# EAGLE design COMPOSITE_SCH (EAGLE 9.2.2)
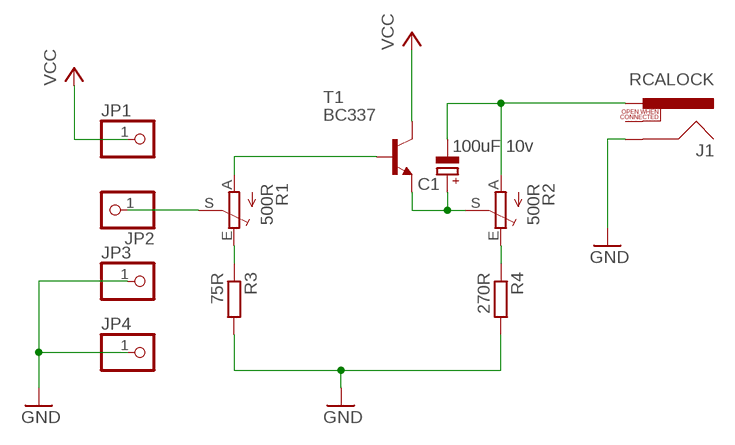
[diagram p0: schematic, sheet 1]

## Parts
C1  100uF 10v  CPOL-EUE2,5-6E  [E2,5-6E]
J1  RCALOCK  [RCA_LOCK]
JP1  PINHD-1X1  [1X01]
JP2  PINHD-1X1  [1X01]
JP3  PINHD-1X1  [1X01]
JP4  PINHD-1X1  [1X01]
R1  500R  TRIM_EU-CA6V  [CA6V]
R2  500R  TRIM_EU-CA6V  [CA6V]
R3  75R  R-EU_0207/10  [0207/10]
R4  270R  R-EU_0207/10  [0207/10]
T1  BC337  [TO92]

## Nets
GND: J1.SHELL JP3.1 JP4.1 R3.2 R4.2
N$1: R1.A T1.2(B)
N$2: R1.E R3.1
N$3: C1.+ R2.S T1.1(E)
N$4: R2.E R4.1
N$6: C1.- J1.PIN R2.A
N$8: JP2.1 R1.S
VCC: JP1.1 T1.3(C)
Unconnected: J1.SWITCH

## Library data of the parts
C1 = rcl:CPOL-EU: POLARIZED CAPACITOR, European symbol; SPICEPREFIX: C
J1 = SparkFun-Connectors:RCA: RCA Jack connector This is a right angle RCA jack connecotr. Commonly used for video or audio. Here is the connector we sell at SparkFun: RCA Jack <https://www.sparkfun.com/products/8631> (PRT-08631) Datasheet <http://www.sparkfun.com/datasheets/Prototyping/Connectors/RCA-Jack.pdf> It is not used on any active designs, however it was used on a couple retired products: RCA Jack Breakout [RETIRED] <https://www.sparkfun.com/products/8826> (PRT-08826) SparkFun On Screen Display Breakout - MAX7456 [RETIRED] <https://www.sparkfun.com/products/9168> (BOB-09168) You may also be interested in a cable: RCA Video Cable - 6' <https://www.sparkfun.com/products/11573> (CAB-11573)
JP1-JP4 = pinhead:PINHD-1X1: PIN HEADER
R1 R2 = pot:TRIM_EU-: POTENTIOMETER
R3 R4 = rcl:R-EU_: RESISTOR, European symbol; SPICEPREFIX: R
T1 = transistor:BC337: NPN TRANSISTOR

## Net classes
0 default: width 0.508 mm

## Board
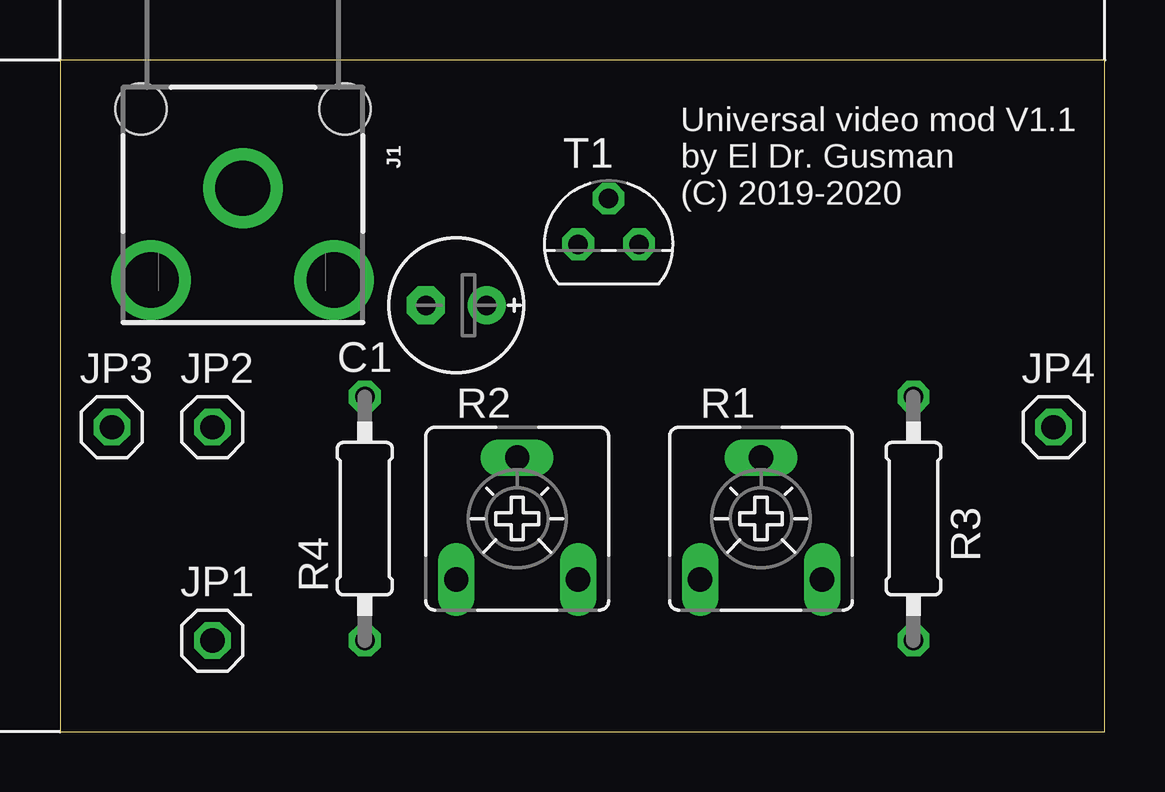
[diagram p1: board, top side]
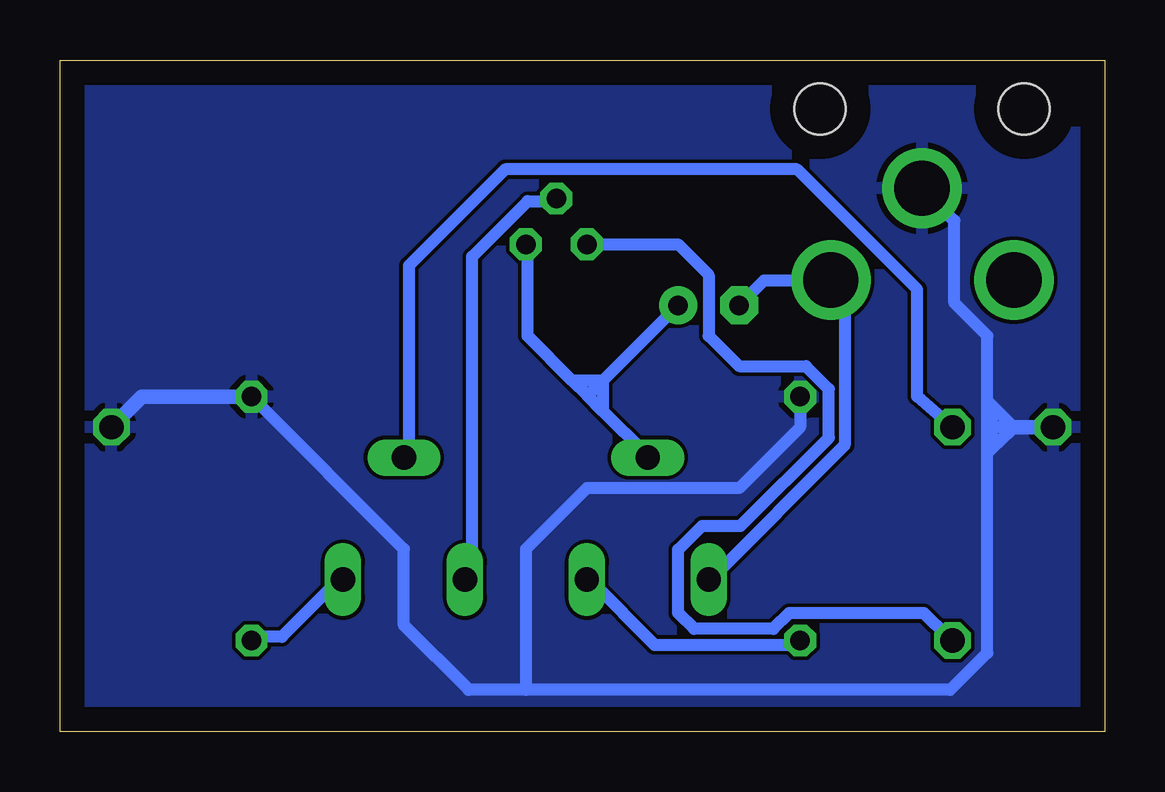
[diagram p2: board, bottom side, seen from below]

Size 43.54 x 28 mm. Coordinates in mm from the lower left corner, seen from the top.
Outline: 0,0 43.54,0 43.54,28 0,28 0,0
Copper layers (1*16): Top 0.035mm / dielectric 1.5mm / Bottom 0.035mm
Design rules "default": minimum track width 6mil, minimum drill 0.35mm, track to track 6mil, track to pad 6mil, pad to pad 6mil, via to via 6mil, smd to smd 6mil, copper to edge 40mil, drill to drill 6mil, minimum pad ring 10mil, minimum via ring 8mil, stop-mask expansion 4mil, vias tented up to drill 0mil, thermal gap 10mil

### Footprints (pad centres in the part's own frame; a part is rotated, then mirrored left to right if it is on the bottom)
E2,5-6E = drill 0.813 pad 1.575: + -1.27,0 | drill 0.813 pad 1.575 octagon: - 1.27,0
RCA_LOCK = drill 2.3: PIN 4.03,3.802; SHELL 0.203,0; SWITCH 4.03,-3.827 | hole 2.134: -3.1,4.25; -3.1,-4.25
1X01 = drill 1.016 octagon: 1 0,0
CA6V = drill 1.016 long: A -2.54,-2.54; E 2.54,-2.54; S 0,2.54
0207/10 = drill 0.813 octagon: 1 -5.08,0; 2 5.08,0
TO92 = drill 0.813 octagon: 1 1.27,0; 2 0,1.905; 3 -1.27,0

### Placement (x,y rotation side)
C1  16.51,17.78 180 top
J1  7.62,22.86 270 top
JP1  6.35,3.81 0 top
JP2  6.35,12.7 0 top
JP3  2.16,12.7 0 top
JP4  41.4,12.7 0 top
R1  29.21,8.89 0 top
R2  19.05,8.89 0 top
R3  35.56,8.89 90 top
R4  12.7,8.89 90 top
T1  22.86,20.32 0 top

### Tracks (layer width: path | path; a pad name or v marks a point on that pad's centre or on a via)
GND
  Bottom 0.508: 4.9,11.61 4.9,3.3 6.45,1.75 24.13,1.75 | 4.9,11.61 4.9,12.52 | 4.9,12.52 4.9,13.79 | 4.9,13.79 4.9,16.51 6.27,17.88 6.27,21.31 J1.SHELL | 24.13,1.75 26.52,1.75 29.21,4.45 29.21,7.62 R3.2 | R4.2 12.7,12.7 15.24,10.16 21.59,10.16 24.13,7.62 24.13,1.75 | 4.45,12.06 4.9,11.61 | 4.9,12.52 4.45,12.06 | 4.45,12.06 3.81,12.7 | 4.9,13.79 4.45,13.34 | 4.45,13.34 3.81,12.7 | 3.81,12.7 4.72,12.7 4.9,12.52 | 4.9,12.52 4.9,12.88 4.45,13.34
  Bottom 0.61: JP3.1 3.81,12.7 | JP4.1 40.13,13.97 R3.2
  pour Bottom: -1.27,29.21 -1.27,-1.27 45.72,-1.27 45.72,29.21
N$1
  Bottom 0.508: T1.2 23.06,22.12 24.05,22.12 26.36,19.81 26.36,6.6 R1.A
N$2
  Bottom 0.508: R3.1 35.28,3.96 34.29,3.96 31.98,6.27 R1.E
N$3
  Bottom 0.508: 20.92,13.37 19.1,11.56 R2.S | 20.92,13.37 21.55,14.01 | 21.55,14.01 22.19,14.64 | 22.19,14.64 24.05,16.51 24.05,20.14 T1.1 | C1.+ 20.92,14.64 | 20.92,14.64 21.55,14.01 | 20.92,14.64 20.92,13.37 | 20.92,14.64 22.19,14.64
N$4
  Bottom 0.508: R4.1 12.83,3.63 18.77,3.63 21.41,6.27 R2.E
N$6
  Bottom 0.508: R2.A 16.43,6.35 10.85,11.94 10.85,18.49 11.18,18.82 | 11.18,18.82 J1.PIN | C1.- 14.2,18.82 11.18,18.82
N$8
  Bottom 0.508: R1.S 29.01,11.56 29.01,19.43 24.99,23.44 12.83,23.44 7.82,18.44 7.82,13.99 JP2.1
VCC
  Bottom 0.508: JP1.1 6.55,3.96 7.54,4.95 13.16,4.95 13.82,4.29 17.12,4.29 17.78,4.95 17.78,7.59 16.79,8.59 15.19,8.59 11.51,12.27 11.51,14.29 12.46,15.24 15.24,15.24 16.51,16.51 16.51,19.05 17.78,20.32 T1.3

### Text on the board
tNames: Universal video mod V1.1 / by El Dr. Gusman / (C) 2019-2020